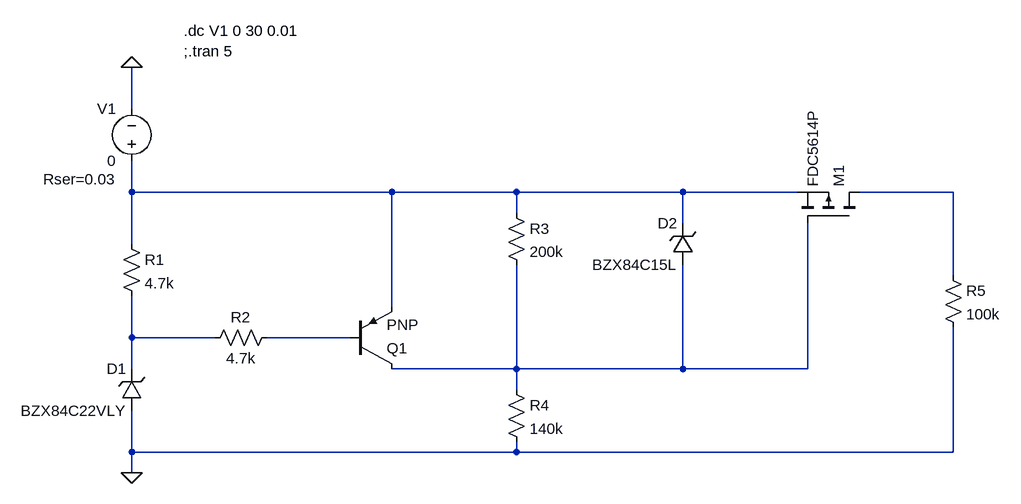
[diagram p0: schematic Draft2.asc]
Draft2.asc, the LTspice schematic file:
Version 4.1
SHEET 1 1456 692
WIRE 112 112 112 48
WIRE 112 240 112 192
WIRE 512 240 112 240
WIRE 704 240 512 240
WIRE 960 240 704 240
WIRE 1136 240 960 240
WIRE 1376 240 1232 240
WIRE 704 272 704 240
WIRE 960 288 960 240
WIRE 112 320 112 240
WIRE 1376 368 1376 240
WIRE 512 416 512 240
WIRE 112 464 112 400
WIRE 240 464 112 464
WIRE 448 464 320 464
WIRE 112 512 112 464
WIRE 704 512 704 352
WIRE 704 512 512 512
WIRE 960 512 960 352
WIRE 960 512 704 512
WIRE 1152 512 1152 288
WIRE 1152 512 960 512
WIRE 704 544 704 512
WIRE 112 640 112 576
WIRE 704 640 704 624
WIRE 704 640 112 640
WIRE 1376 640 1376 448
WIRE 1376 640 704 640
WIRE 112 672 112 640
FLAG 112 48 0
FLAG 112 672 0
SYMBOL voltage 112 208 R180
WINDOW 0 24 96 Left 2
WINDOW 3 24 16 Left 2
WINDOW 123 0 0 Left 0
WINDOW 39 24 -12 Left 2
SYMATTR InstName V1
SYMATTR Value 0
SYMATTR SpiceLine Rser=0.03
SYMBOL res 96 304 R0
SYMATTR InstName R1
SYMATTR Value 4.7k
SYMATTR SpiceLine tol=5
SYMBOL zener 128 576 R180
WINDOW 0 24 64 Left 2
WINDOW 3 24 0 Left 2
SYMATTR InstName D1
SYMATTR Value BZX84C22VLY
SYMBOL pnp 448 512 M180
SYMATTR InstName Q1
SYMBOL res 336 448 R90
WINDOW 0 0 56 VBottom 2
WINDOW 3 32 56 VTop 2
SYMATTR InstName R2
SYMATTR Value 4.7k
SYMATTR SpiceLine tol=5
SYMBOL res 688 256 R0
SYMATTR InstName R3
SYMATTR Value 200k
SYMATTR SpiceLine tol=1
SYMBOL res 688 528 R0
SYMATTR InstName R4
SYMATTR Value 140k
SYMATTR SpiceLine tol=1
SYMBOL zener 976 352 R180
WINDOW 0 24 64 Left 2
WINDOW 3 24 0 Left 2
SYMATTR InstName D2
SYMATTR Value BZX84C15L
SYMBOL pmos 1232 288 M270
SYMATTR InstName M1
SYMATTR Value FDC5614P
SYMBOL res 1360 352 R0
SYMATTR InstName R5
SYMATTR Value 100k
SYMATTR SpiceLine tol=5
TEXT 192 -8 Left 2 !.dc V1 0 30 0.01\n;.tran 5

The netlist it stands for:
* Draft2.asc
V1 N001 0 0 Rser=0.03
R1 N001 N003 4.7k tol=5
D1 0 N003 BZX84C22VLY
Q1 N005 N004 N001 0 PNP
R2 N004 N003 4.7k tol=5
R3 N001 N005 200k tol=1
R4 N005 0 140k tol=1
D2 N005 N001 BZX84C15L
M1 N002 N005 N001 N001 FDC5614P
R5 N002 0 100k tol=5
.model D D
.lib standard.dio
.model NPN NPN
.model PNP PNP
.lib standard.bjt
.model NMOS NMOS
.model PMOS PMOS
.lib standard.mos
.dc V1 0 30 0.01
;.tran 5
.backanno
.end